# EAGLE design icp (EAGLE 6.3)
Assembly variants: Reichelt
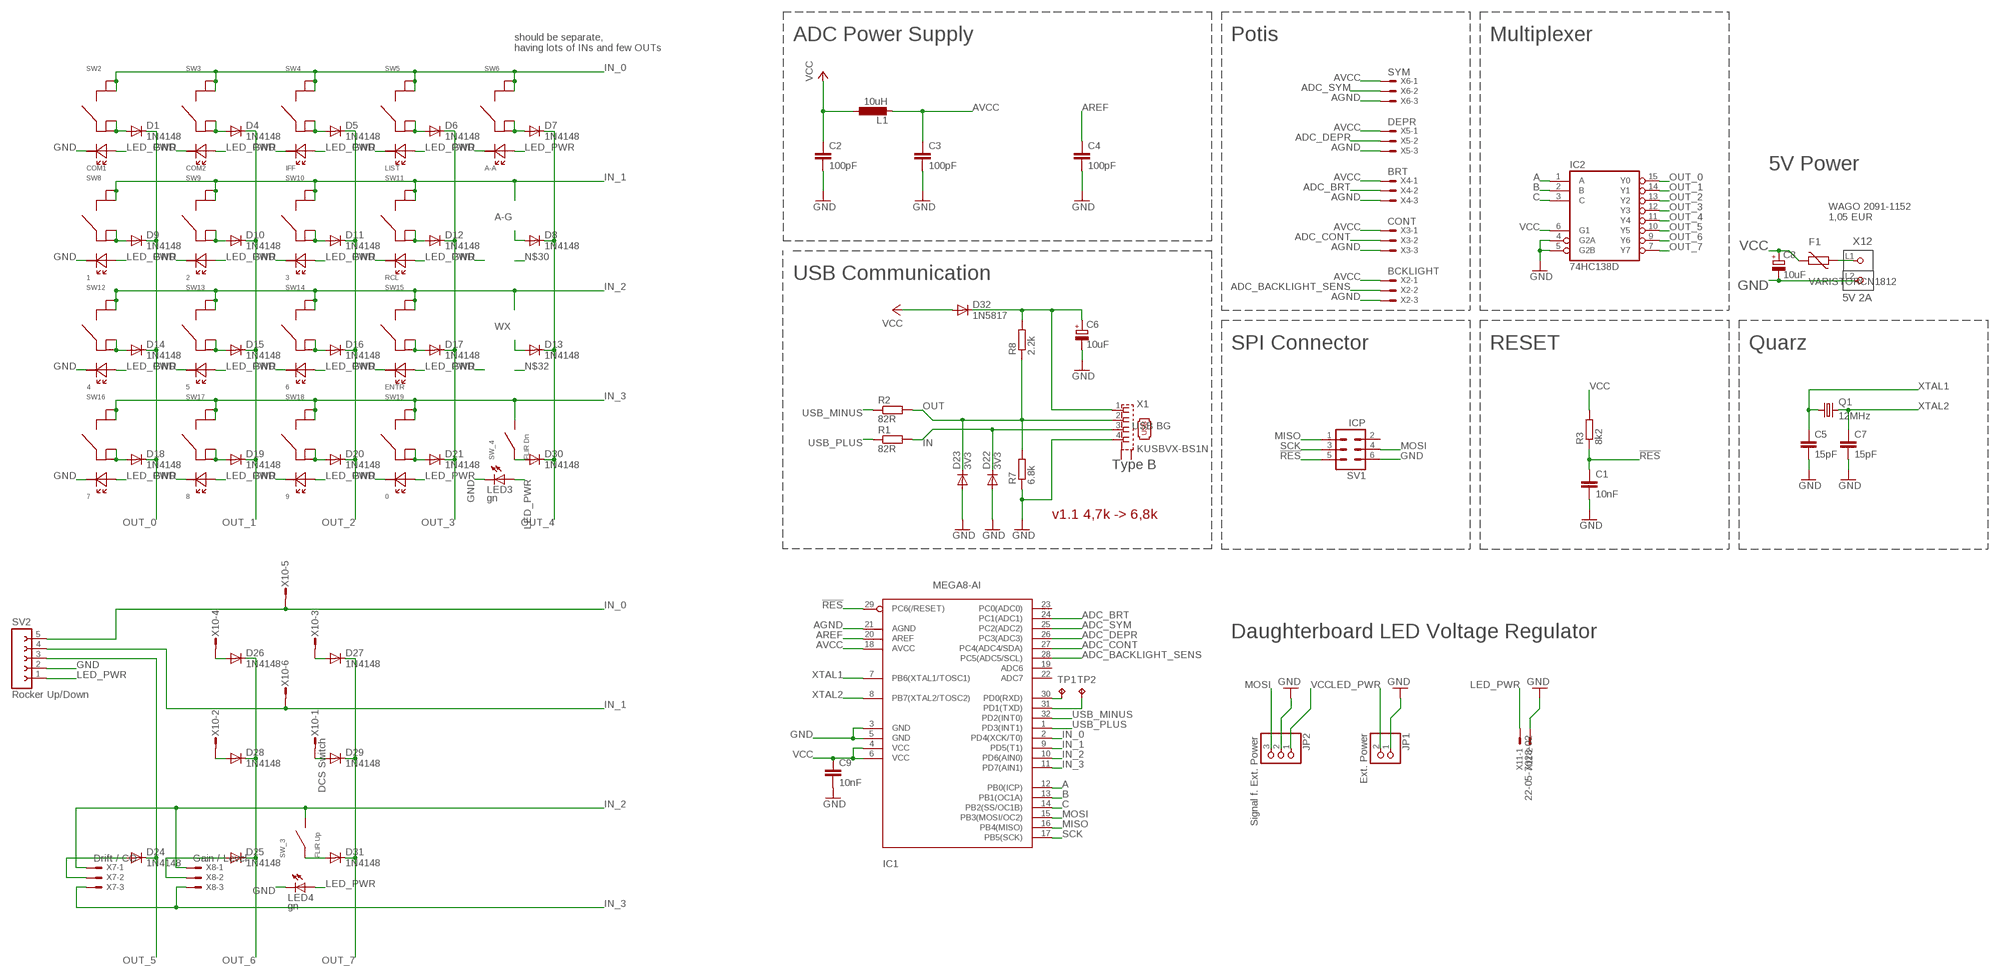
[diagram p0: schematic, sheet 1]

## Parts
C1  10nF  C-EUC1206  [C1206]
C2  100pF  C-EUC0805  [C0805]
C3  100pF  C-EUC0805  [C0805]
C4  100pF  C-EUC0805  [C0805]
C5  15pF  C-EUC0805  [C0805]
C6  10uF  CPOL-EUE2-5  [E2-5]  (variant Reichelt: RAD 10/100)
C7  15pF  C-EUC0805  [C0805]
C8  10uF  CPOL-EUE2-5  [E2-5]
C9  10nF  C-EUC1206  [C1206]
D1  1N4148  DIODE-DO35-10  [DO35-10]
D4  1N4148  DIODE-DO35-10  [DO35-10]
D5  1N4148  DIODE-DO35-10  [DO35-10]
D6  1N4148  DIODE-DO35-10  [DO35-10]
D7  1N4148  DIODE-DO35-10  [DO35-10]
D8  1N4148  DIODE-DO35-10  [DO35-10]
D9  1N4148  DIODE-DO35-10  [DO35-10]
D10  1N4148  DIODE-DO35-10  [DO35-10]
D11  1N4148  DIODE-DO35-10  [DO35-10]
D12  1N4148  DIODE-DO35-10  [DO35-10]
D13  1N4148  DIODE-DO35-10  [DO35-10]
D14  1N4148  DIODE-DO35-10  [DO35-10]
D15  1N4148  DIODE-DO35-10  [DO35-10]
D16  1N4148  DIODE-DO35-10  [DO35-10]
D17  1N4148  DIODE-DO35-10  [DO35-10]
D18  1N4148  DIODE-DO35-10  [DO35-10]
D19  1N4148  DIODE-DO35-10  [DO35-10]
D20  1N4148  DIODE-DO35-10  [DO35-10]
D21  1N4148  DIODE-DO35-10  [DO35-10]
D22  3V3  DIODE-D-5  [D-5]
D23  3V3  DIODE-D-5  [D-5]
D24  1N4148  DIODE-DO35-10  [DO35-10]
D25  1N4148  DIODE-DO35-10  [DO35-10]
D26  1N4148  DIODE-DO35-10  [DO35-10]
D27  1N4148  DIODE-DO35-10  [DO35-10]
D28  1N4148  DIODE-DO35-10  [DO35-10]
D29  1N4148  DIODE-DO35-10  [DO35-10]
D30  1N4148  DIODE-DO35-10  [DO35-10]
D31  1N4148  DIODE-DO35-10  [DO35-10]
D32  1N5817  DIODE-DO35-10  [DO35-10]
F1  VARISTORCN1812  [CT/CN1812]
IC1  MEGA8-AI  [TQFP32-08]
IC2  74HC138D  [SO16]
JP1  Ext. Power  PINHD-1X2  [1X02]
JP2  Signal f. Ext. Power  PINHD-1X3  [1X03]
L1  10uH  L-EU0207/15  [0207/15]
LED3  gn  LEDCHIPLED_1206  [CHIPLED_1206]
LED4  gn  LEDCHIPLED_1206  [CHIPLED_1206]
Q1  12MHz  CRYSTALHC49U-V  [HC49U-V]
R1  82R  R-EU_R0805W  [R0805W]
R2  82R  R-EU_R0805W  [R0805W]
R3  8k2  R-EU_R0805  [R0805]
R7  6.8k  R-EU_0207/5V  [0207/5V]  (variant Reichelt: SMD-0805 4,70k)
R8  2.2k  R-EU_R0805  [R0805]  (variant Reichelt: SMD-0805 2,20k)
SV1  ICP  MA03-2  [MA03-2]
SV2  Rocker Up/Down  FE05-1  [FE05-1]
SW2  COM1  3FTL620  [3FTL620]
SW3  COM2  3FTL620  [3FTL620]
SW4  IFF  3FTL620  [3FTL620]
SW5  LIST  3FTL620  [3FTL620]
SW6  A-A  3FTL620  [3FTL620]
SW8  1  3FTL620  [3FTL620]
SW9  2  3FTL620  [3FTL620]
SW10  3  3FTL620  [3FTL620]
SW11  RCL  3FTL620  [3FTL620]
SW12  4  3FTL620  [3FTL620]
SW13  5  3FTL620  [3FTL620]
SW14  6  3FTL620  [3FTL620]
SW15  ENTR  3FTL620  [3FTL620]
SW16  7  3FTL620  [3FTL620]
SW17  8  3FTL620  [3FTL620]
SW18  9  3FTL620  [3FTL620]
SW19  0  3FTL620  [3FTL620]
SW_3  FLIR Up  APEM_SWITCH  [TYPE_A]
SW_4  FLIR Dn  APEM_SWITCH  [TYPE_A]
TP1  TPTP06SQ  [TP06SQ]
TP2  TPTP06SQ  [TP06SQ]
X1  KUSBVX-BS1N  [KUSBVX-BS1N]
X2  BCKLIGHT  22-23-2031  [22-23-2031]
X3  CONT  22-23-2031  [22-23-2031]
X4  BRT  22-23-2031  [22-23-2031]
X5  DEPR  22-23-2031  [22-23-2031]
X6  SYM  22-23-2031  [22-23-2031]
X7  Drift / CO  22-23-2031  [22-23-2031]
X8  Gain / Level  22-23-2031  [22-23-2031]
X10  DCS Switch  MICROMATCH-6  [MICROMATCH-6]
X11  22-05-7028-02  [7395-02]
X12  5V 2A  2091-1152  [P-2091-1152]

## Nets
!RES: C1.1 IC1.29(PC6(/RESET)) R3.1 SV1.5
A: IC1.12(PB0(ICP)) IC2.1(A)
ADC_BACKLIGHT_SENS: IC1.28(PC5(ADC5/SCL)) X2.2
ADC_BRT: IC1.24(PC1(ADC1)) X4.2
ADC_CONT: IC1.27(PC4(ADC4/SDA)) X3.2
ADC_DEPR: IC1.26(PC3(ADC3)) X5.2
ADC_SYM: IC1.25(PC2(ADC2)) X6.2
AGND: IC1.21(AGND) X2.3 X3.3 X4.3 X5.3 X6.3
AREF: C4.1 IC1.20(AREF)
AVCC: C3.1 IC1.18(AVCC) L1.2 X2.1 X3.1 X4.1 X5.1 X6.1
B: IC1.13(PB1(OC1A)) IC2.2(B)
C: IC1.14(PB2(SS/OC1B)) IC2.3(C)
GND: C1.2 C2.2 C3.2 C4.2 C5.2 C6.- C7.2 C8.- C9.2 D22.A D23.A IC1.3(GND) IC1.5(GND) IC2.4(G2A) IC2.5(G2B) JP1.1 JP2.2 LED3.C LED4.C R7.1 SV1.6 SV2.2 SW2.P$6(LED$4) SW3.P$6(LED$4) SW4.P$6(LED$4) SW5.P$6(LED$4) SW6.P$6(LED$4) SW8.P$6(LED$4) SW9.P$6(LED$4) SW10.P$6(LED$4) SW11.P$6(LED$4) SW12.P$6(LED$4) SW13.P$6(LED$4) SW14.P$6(LED$4) SW15.P$6(LED$4) SW16.P$6(LED$4) SW17.P$6(LED$4) SW18.P$6(LED$4) SW19.P$6(LED$4) X1.4 X11.2 X12.L2(P2)
IN: D22.C R1.2 X1.3
IN_0: IC1.2(PD4(XCK/T0)) SV2.5 SW2.P$1 SW2.P$3 SW3.P$1 SW3.P$3 SW4.P$1 SW4.P$3 SW5.P$1 SW5.P$3 SW6.P$1 SW6.P$3 X10.5
IN_1: IC1.9(PD5(T1)) SV2.4 SW8.P$1 SW8.P$3 SW9.P$1 SW9.P$3 SW10.P$1 SW10.P$3 SW11.P$1 SW11.P$3 X10.6
IN_2: IC1.10(PD6(AIN0)) SW12.P$1 SW12.P$3 SW13.P$1 SW13.P$3 SW14.P$1 SW14.P$3 SW15.P$1 SW15.P$3 SW_3.P$1 X7.1 X8.1
IN_3: IC1.11(PD7(AIN1)) SW16.P$1 SW16.P$3 SW17.P$1 SW17.P$3 SW18.P$1 SW18.P$3 SW19.P$1 SW19.P$3 SW_4.P$1 X7.3 X8.3
LED_PWR: JP1.2 LED3.A LED4.A SV2.1 SW2.P$5(LED$3) SW3.P$5(LED$3) SW4.P$5(LED$3) SW5.P$5(LED$3) SW6.P$5(LED$3) SW8.P$5(LED$3) SW9.P$5(LED$3) SW10.P$5(LED$3) SW11.P$5(LED$3) SW12.P$5(LED$3) SW13.P$5(LED$3) SW14.P$5(LED$3) SW15.P$5(LED$3) SW16.P$5(LED$3) SW17.P$5(LED$3) SW18.P$5(LED$3) SW19.P$5(LED$3) X11.1
MISO: IC1.16(PB4(MISO)) SV1.1
MOSI: IC1.15(PB3(MOSI/OC2)) JP2.3 SV1.4
N$1: C6.+ D32.C R8.2 X1.1
N$2: D7.A SW6.P$2 SW6.P$4
N$3: D30.A SW_4.P$2
N$4: F1.1 X12.L1(P1)
N$5: D31.A SW_3.P$2
N$7: D24.A X7.2
N$8: D25.A X8.2
N$9: D26.A X10.4
N$10: D28.A X10.2
N$11: D27.A X10.3
N$12: D1.A SW2.P$2 SW2.P$4
N$13: D9.A SW8.P$2 SW8.P$4
N$14: D4.A SW3.P$2 SW3.P$4
N$15: D5.A SW4.P$2 SW4.P$4
N$16: D6.A SW5.P$2 SW5.P$4
N$17: D12.A SW11.P$2 SW11.P$4
N$18: D11.A SW10.P$2 SW10.P$4
N$19: D10.A SW9.P$2 SW9.P$4
N$20: D14.A SW12.P$2 SW12.P$4
N$21: D15.A SW13.P$2 SW13.P$4
N$22: D16.A SW14.P$2 SW14.P$4
N$23: D17.A SW15.P$2 SW15.P$4
N$24: D18.A SW16.P$2 SW16.P$4
N$25: D19.A SW17.P$2 SW17.P$4
N$26: D20.A SW18.P$2 SW18.P$4
N$27: D21.A SW19.P$2 SW19.P$4
N$28: D13.A
N$29: D29.A X10.1
N$133: D8.A
OUT: D23.C R2.2 R7.2 R8.1 X1.2
OUT_0: D1.C D9.C D14.C D18.C IC2.15(Y0)
OUT_1: D4.C D10.C D15.C D19.C IC2.14(Y1)
OUT_2: D5.C D11.C D16.C D20.C IC2.13(Y2)
OUT_3: D6.C D12.C D17.C D21.C IC2.12(Y3)
OUT_4: D7.C D8.C D13.C D30.C IC2.11(Y4)
OUT_5: D24.C IC2.10(Y5) SV2.3
OUT_6: D25.C D26.C D28.C IC2.9(Y6)
OUT_7: D27.C D29.C D31.C IC2.7(Y7)
RX: IC1.30(PD0(RXD)) TP1.TP
SCK: IC1.17(PB5(SCK)) SV1.3
TX: IC1.31(PD1(TXD)) TP2.TP
USB_MINUS: IC1.32(PD2(INT0)) R2.1
USB_PLUS: IC1.1(PD3(INT1)) R1.1
VCC: C2.1 C8.+ C9.1 D32.A F1.2 IC1.4(VCC) IC1.6(VCC) IC2.6(G1) JP2.1 L1.1 R3.2
XTAL1: C5.1 IC1.7(PB6(XTAL1/TOSC1)) Q1.1
XTAL2: C7.1 IC1.8(PB7(XTAL2/TOSC2)) Q1.2
Unconnected: IC1.19(ADC6) IC1.22(ADC7) IC1.23(PC0(ADC0)) SV1.2 X1.M1(S1) X1.M2(S2)

## Notes on the sheet
- ADC Power Supply | Potis | Multiplexer
- should be separate,
  having lots of INs and few OUTs
- 5V Power
- A-G
- WAGO 2091-1152
  1,05 EUR
- USB Communication
- WX
- SPI Connector | RESET | Quarz
- Type B
- v1.1 4,7k -> 6,8k
- Daughterboard LED Voltage Regulator

## Power pins joined to a net without a drawn wire
GND: IC2.8(GND)
VCC: IC2.16(VCC)

## Library data of the parts
C1-C5 C7 C9 = rcl:C-EU: CAPACITOR, European symbol
C6 C8 = rcl:CPOL-EU: POLARIZED CAPACITOR, European symbol
D1 D4-D32 = diode:DIODE-: DIODE
F1 = varistor:VARISTOR: VARISTOR
IC1 = avr-6:MEGA8: MICROCONTROLLER 8 Kbytes FLASH 1 kbytes SRAM 512 bytes EEPROM USART 6-channel 10 bit ADC 2-channel 8 bit ADC
IC2 = 74xx-eu:74*138: 3-line to 8-line DECODER/DEMULTIPLEXER
JP1 = pinhead:PINHD-1X2: PIN HEADER
JP2 = pinhead:PINHD-1X3: PIN HEADER
L1 = rcl:L-EU: INDUCTOR, European symbol
LED3 LED4 = led:LED: LED OSRAM: - CHIPLED LG R971, LG N971, LY N971, LG Q971, LY Q971, LO R971, LY R971 LH N974, LH R974 LS Q976, LO Q976, LY Q976 LO Q996 - Hyper CHIPLED LW Q18S LB Q993, LB Q99A, LB R99A - SideLED LS A670, LO A670, LY A670, LG A670, LP A670 LB A673, LV A673, LT A673, LW A673 LH A674 LY A675 LS A676, LA A676, LO A676, LY A676, LW A676 LS A679, LY A679, LG A679 - Hyper Micro SIDELED® LS Y876, LA Y876, LO Y876, LY Y876 LT Y87S - SmartLED LW L88C, LW L88S LB L89C, LB L89S, LG L890 LS L89K, LO L89K, LY L89K LS L896, LA L896, LO L896, LY L896 - TOPLED LS T670, LO T670, LY T670, LG T670, LP T670 LSG T670, LSP T670, LSY T670, LOP T670, LYG T670 LG T671, LOG T671, LSG T671 LB T673, LV T673, LT T673, LW T673 LH T674 LS T676, LA T676, LO T676, LY T676, LB T676, LH T676, LSB T676, LW T676 LB T67C, LV T67C, LT T67C, LS T67K, LO T67K, LY T67K, LW E67C LS E67B, LA E67B, LO E67B, LY E67B, LB E67C, LV E67C, LT E67C LW T67C LS T679, LY T679, LG T679 LS T770, LO T770, LY T770, LG T770, LP T770 LB T773, LV T773, LT T773, LW T773 LH T774 LS E675, LA E675, LY E675, LS T675 LS T776, LA T776, LO T776, LY T776, LB T776 LHGB T686 LT T68C, LB T68C - Hyper Mini TOPLED® LB M676 - Mini TOPLED Santana® LG M470 LS M47K, LO M47K, LY M47K Source: http://www.osram.convergy.de LUXEON: - LUMILED® LXK2-PW12-R00, LXK2-PW12-S00, LXK2-PW14-U00, LXK2-PW14-V00 LXK2-PM12-R00, LXK2-PM12-S00, LXK2-PM14-U00 LXK2-PE12-Q00, LXK2-PE12-R00, LXK2-PE12-S00, LXK2-PE14-T00, LXK2-PE14-U00 LXK2-PB12-K00, LXK2-PB12-L00, LXK2-PB12-M00, LXK2-PB14-N00, LXK2-PB14-P00, LXK2-PB14-Q00 LXK2-PR12-L00, LXK2-PR12-M00, LXK2-PR14-Q00, LXK2-PR14-R00 LXK2-PD12-Q00, LXK2-PD12-R00, LXK2-PD12-S00 LXK2-PH12-R00, LXK2-PH12-S00 LXK2-PL12-P00, LXK2-PL12-Q00, LXK2-PL12-R00 Source: www.luxeon.com KINGBRIGHT: KA-3528ASYC Source: www.kingbright.com
Q1 = crystal:CRYSTAL: CRYSTAL
R1-R3 R7 R8 = rcl:R-EU_: RESISTOR, European symbol
SV1 = con-lstb:MA03-2: PIN HEADER
SV2 = con-lsta:FE05-1: FEMALE HEADER; OC_FARNELL: unknown; OC_NEWARK: unknown
SW2-SW6 SW8-SW19 = switches:3FTL6: Taster Serie 3FTL6 mit 3N Betätigungskraft
SW_3 SW_4 = switches:APEM_SWITCH: slim single pole switches; RS_ONLINE: 378-6296
TP1 TP2 = testpad:TP: Test pad
X1 = con-kycon:KUSBVX-BS1N: USB B-type Receptacle Vertical, 4 Position, Through Hole Source: Sibalco Kycon KUSBVX-BS1N-xxx.pdf; REICHELT: USB BG
X2-X8 = con-molex:22-23-2031: .100" (2.54mm) Center Header - 3 Pin; MF: MOLEX; MPN: 22-23-2031; OC_FARNELL: 1462950; OC_NEWARK: 30C0862
X10 = con-amp-micromatch:MICROMATCH-6: MicroMaTch 6 7-215464-6 / 0-215464-6 Drawing Number C-215464 DDEController.pdf; MPN: 7-215464-6; OC_FARNELL: 3784630; OC_NEWARK: 19R8125
X11 = con-molex:22-?-02: CONNECTOR wire to board 2.54 mm (.1 inch) pitch header; OC_FARNELL: 9731601; OC_NEWARK: unknown
X12 = con-wago_3.5 mm:2091-1152: Serie 2091, Federleiste eCOM mit geraden Lötstiften mit Griffplatte / Series 2091, eCOM pluggable PCB connector with straight solder pins with gripping plate Polzahl / Pole No.: 2 Rastermaß / Pitch: 3.5 mm Bemessungsspannung / Rated Voltage: 160 V Nennstrom / Nominal Current: 10 A Leiterquerschnitt / Conductor Size: 0.2 - 1.5 mm² Anschlusstechnik / Connection Technology: CAGE CLAMP® S Lötstiftlänge: / Solder Pin Length: 3.6 mm Farbe / Color: lichtgrau / light gray Stand: 01.01.2013. Die jeweils aktuellen Daten zu diesem Artikel finden Sie in unserem Produktkatalog, den Sie unter www.wago.com einsehen können. As of: 01/01/2013. Please find the newest data for this article in our product catalogue, which can be viewed under www.wago.com.

## Board
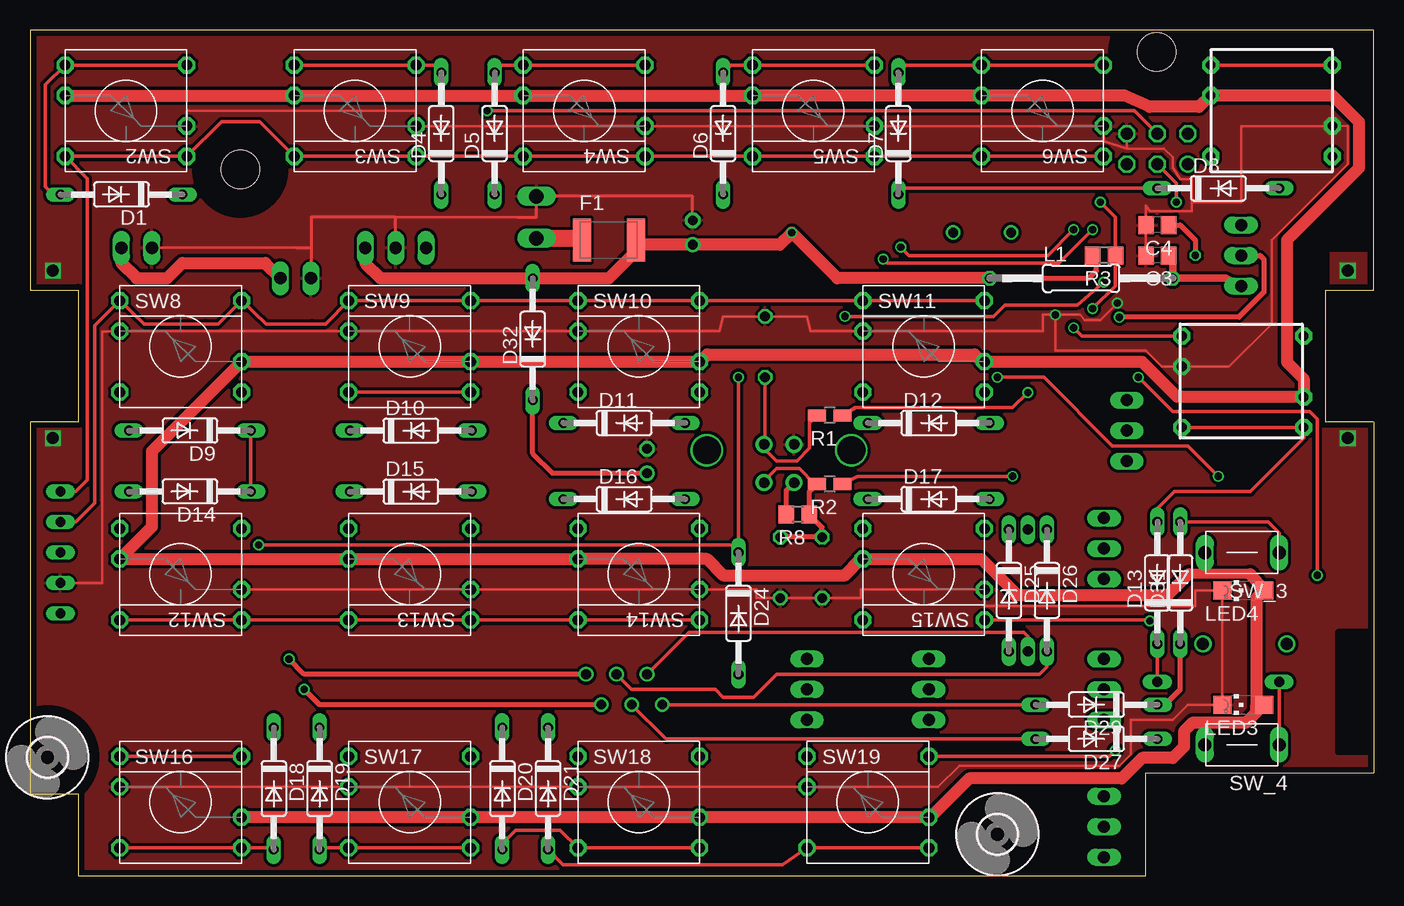
[diagram p1: board, top side]
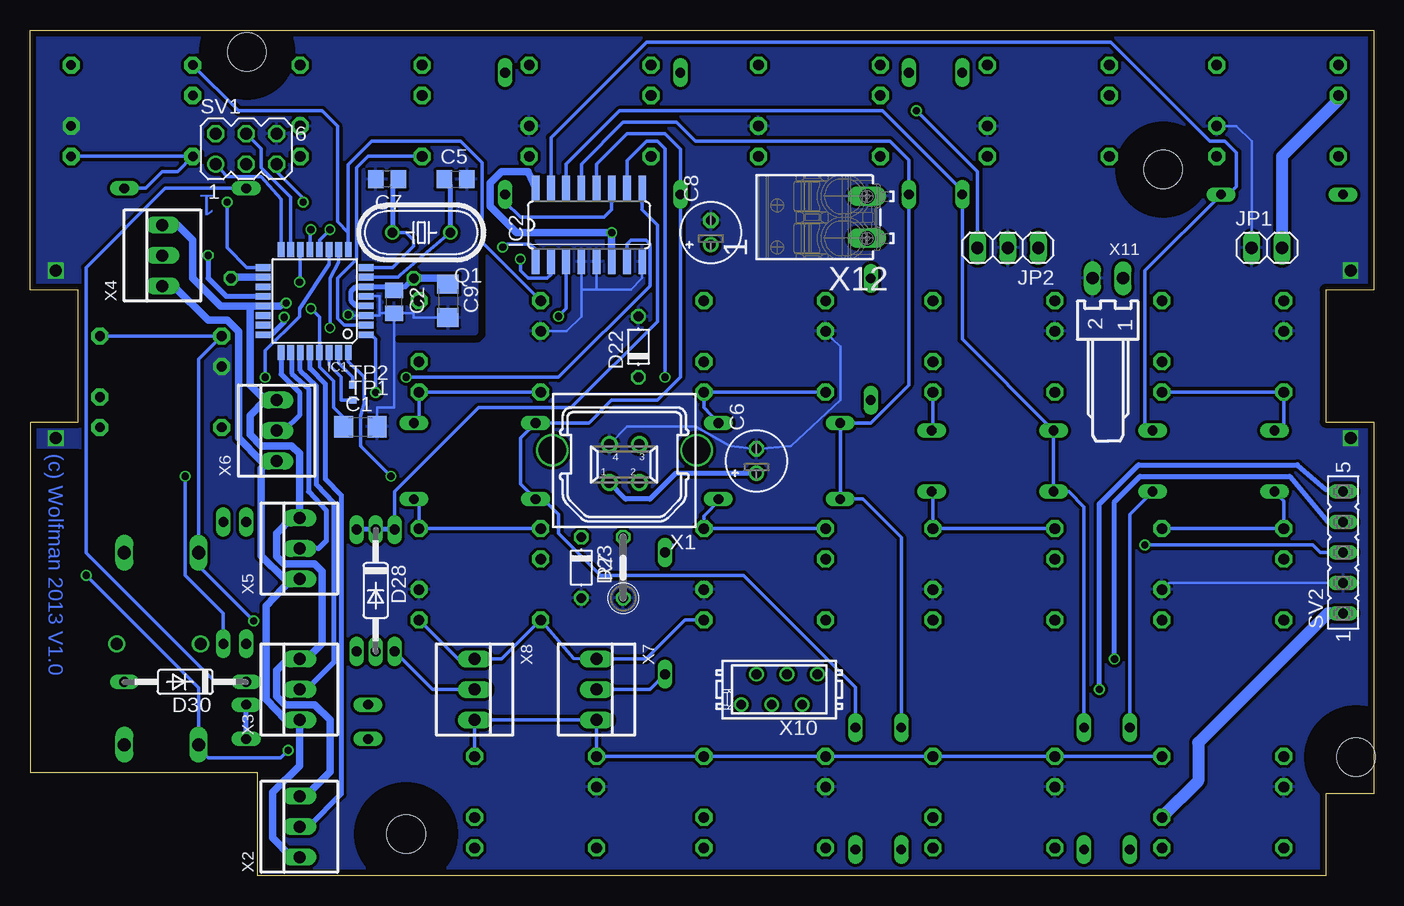
[diagram p2: board, bottom side, seen from below]

Size 112 x 70.5 mm. Coordinates in mm from the lower left corner, seen from the top.
Outline: 4,0 93.03,0 93.03,8.55 112,8.55 112,37.82 108,37.82 108,48.82 112,48.82 112,70.5 0,70.5 0,48.82 4,48.82 4,37.82 0,37.82 0,6.82 4,6.82 4,0
Copper layers (1*16): Top 0.035mm / dielectric 1.5mm / Bottom 0.035mm
Design rules "PCB-POOL": minimum track width 6mil, minimum drill 12mil, track to track 6mil, track to pad 6mil, pad to pad 6mil, via to via 6mil, smd to smd 6mil, copper to edge 20mil, drill to drill 8mil, minimum pad ring 8mil, minimum via ring 6mil, stop-mask expansion 3mil, vias tented up to drill 0mil, thermal gap 8mil
Holes 3.2 mm at 17.54,58.87 93.9,68.67
tRestrict: area 13.9,55.3 to 21.1,62.5; area 90.3,65.1 to 97.5,72.3; area 109,10.3 to 111.8,20.3; 2 lines
bRestrict: area 13.9,55.3 to 21.1,62.5; area 90.3,65.1 to 97.5,72.3; 4 lines

### Footprints (pad centres in the part's own frame; a part is rotated, then mirrored left to right if it is on the bottom)
C1206 = smd 1.6 x 1.8: 1 -1.4,0; 2 1.4,0
C0805 = smd 1.3 x 1.5: 1 -0.95,0; 2 0.95,0
E2-5 = drill 0.813 pad 1.27: + -1.016,0 | drill 0.813 pad 1.27 octagon: - 1.016,0
DO35-10 = drill 0.813 long: A 5.08,0; C -5.08,0
D-5 = drill 0.813 octagon: A 2.54,0; C -2.54,0
CT/CN1812 = smd 1.5 x 3.6: 1 -2.25,0; 2 2.25,0
TQFP32-08 = smd 1.27 x 0.559: 1 -4.293,2.8; 2 -4.293,2; 3 -4.293,1.2; 4 -4.293,0.4; 5 -4.293,-0.4; 6 -4.293,-1.2; 7 -4.293,-2; 8 -4.293,-2.8; 17 4.293,-2.8; 18 4.293,-2; 19 4.293,-1.2; 20 4.293,-0.4; 21 4.293,0.4; 22 4.293,1.2; 23 4.293,2; 24 4.293,2.8 | smd 0.559 x 1.27: 9 -2.8,-4.293; 10 -2,-4.293; 11 -1.2,-4.293; 12 -0.4,-4.293; 13 0.4,-4.293; 14 1.2,-4.293; 15 2,-4.293; 16 2.8,-4.293; 25 2.8,4.293; 26 2,4.293; 27 1.2,4.293; 28 0.4,4.293; 29 -0.4,4.293; 30 -1.2,4.293; 31 -2,4.293; 32 -2.8,4.293
SO16 = smd 0.66 x 2.032: 1 -4.445,-3.073; 2 -3.175,-3.073; 3 -1.905,-3.073; 4 -0.635,-3.073; 5 0.635,-3.073; 6 1.905,-3.073; 7 3.175,-3.073; 8 4.445,-3.073; 9 4.445,3.073; 10 3.175,3.073; 11 1.905,3.073; 12 0.635,3.073; 13 -0.635,3.073; 14 -1.905,3.073; 15 -3.175,3.073; 16 -4.445,3.073
1X02 = drill 1.016 long: 1 -1.27,0; 2 1.27,0
1X03 = drill 1.016 long: 1 -2.54,0; 2 0,0; 3 2.54,0
0207/15 = drill 0.813 octagon: 1 -7.62,0; 2 7.62,0
CHIPLED_1206 = smd 1.5 x 1.5: A 0,-1.75; C 0,1.75
HC49U-V = drill 0.813: 1 -2.413,0; 2 2.413,0
R0805W = smd 1.5 x 1: 1 -1.052,0; 2 1.052,0
R0805 = smd 1.3 x 1.5: 1 -0.95,0; 2 0.95,0
0207/5V = drill 0.813 octagon: 1 -2.54,0; 2 2.54,0
MA03-2 = drill 1.016: 1 -2.54,-1.27 | drill 1.016 octagon: 2 -2.54,1.27; 3 0,-1.27; 4 0,1.27; 5 2.54,-1.27; 6 2.54,1.27
FE05-1 = drill 0.813 long: 1 -5.08,0; 2 -2.54,0; 3 0,0; 4 2.54,0; 5 5.08,0
3FTL620 = drill 0.9 pad 1.422 octagon: P$1 -5.08,3.81; P$2 -5.08,-3.81; P$3 5.08,3.81; P$4 5.08,-3.81; P$5 5.08,-1.27; P$6 -5.08,1.27
TYPE_A = drill 1.1 long: P$1 0,3.1; P$2 0,-3.1
TP06SQ = smd 0.6 x 0.6: TP 0,0
3,2 = hole 3.2: 0,0
KUSBVX-BS1N = drill 0.9 pad 1.422: 1 1.25,2.7; 2 -1.25,2.7; 3 -1.25,-0.5; 4 1.25,-0.5 | drill 2.3 pad 2.7: M1 -6.02,0; M2 6.02,0
22-23-2031 = drill 1 long: 1 -2.54,0; 2 0,0; 3 2.54,0
MICROMATCH-6 = drill 0.813: 1 3.175,1.27; 2 1.905,-1.27; 3 0.635,1.27; 4 -0.635,-1.27; 5 -1.905,1.27; 6 -3.175,-1.27
7395-02 = drill 1.016 long: 1 1.27,0; 2 -1.27,0
P-2091-1152 = drill 1.2 long: L1 -3.5,1.75; L2 -3.5,-1.75

### Placement (x,y rotation side)
C1  84.46,37.42 0 bottom
C2  81.66,47.84 270 bottom
C3  93.98,51.7 180 top
C4  93.98,54.24 180 top
C5  76.52,58.05 0 bottom
C6  51.44,34.56 90 bottom
C7  82.23,58.05 180 bottom
C8  55.24,53.61 90 bottom
C9  77.15,47.92 270 bottom
D1  7.62,56.78 180 top
D4  34.29,61.86 90 top
D5  38.73,61.86 90 top
D6  57.78,61.86 90 top
D7  72.39,61.86 90 top
D8  99.06,57.3 0 top
D9  13.34,37.1 180 top
D10  31.75,37.1 0 top
D11  49.53,37.73 0 top
D12  74.93,37.73 0 top
D13  93.98,24.4 90 top
D14  13.34,32.02 180 top
D15  31.75,32.02 0 top
D16  49.53,31.39 0 top
D17  74.93,31.39 0 top
D18  20.32,7.25 270 top
D19  24.13,7.25 270 top
D20  39.37,7.25 270 top
D21  43.18,7.25 270 top
D22  61.28,44.08 90 bottom
D23  66.04,25.67 270 bottom
D24  59.05,21.86 270 top
D25  81.6,23.77 270 top
D26  84.77,23.77 270 top
D27  88.9,11.38 180 top
D28  83.19,23.77 270 bottom
D29  88.9,14.24 180 top
D30  99.06,16.14 180 bottom
D31  95.89,24.4 90 top
D32  41.91,44.72 90 top
F1  48.26,52.97 0 top
IC1  88.27,47.89 180 bottom
IC2  65.41,54.24 0 bottom
JP1  8.89,52.34 0 bottom
JP2  30.48,52.34 180 bottom
L1  87.63,49.8 0 top
LED3  101.13,14.24 90 top
LED4  101.13,23.77 90 top
Q1  79.38,53.61 180 bottom
R1  66.68,38.37 180 top
R2  66.68,32.66 180 top
R3  89.54,51.7 180 top
R7  62.55,25.67 90 bottom
R8  64.01,30.11 180 top
SV1  93.98,60.59 0 bottom
SV2  2.54,26.94 90 bottom
SW2  8,63.77 180 top
SW3  27.1,63.77 180 top
SW4  46.2,63.77 180 top
SW5  65.3,63.77 180 top
SW6  84.4,63.77 180 top
SW8  12.55,44.11 0 top
SW9  31.65,44.11 0 top
SW10  50.75,44.11 0 top
SW11  74.5,44.11 0 top
SW12  12.55,25.11 180 top
SW13  31.65,25.11 180 top
SW14  50.75,25.11 180 top
SW15  74.5,25.11 180 top
SW16  12.55,6.11 0 top
SW17  31.65,6.11 0 top
SW18  50.75,6.11 0 top
SW19  69.85,6.11 0 top
SW_3  101.04,26.92 90 top
SW_4  101.04,10.9 90 top
TP1  85.09,39.64 0 bottom
TP2  85.09,40.91 0 bottom
U$5  [3,2]  80.65,3.45 0 top
U$7  [3,2]  1.45,9.86 0 top
X1  62.45,35.45 180 bottom
X2  89.54,4.08 90 bottom
X3  89.54,15.51 90 bottom
X4  100.97,51.7 90 bottom
X5  89.54,27.26 90 bottom
X6  91.44,37.1 90 bottom
X7  64.77,15.51 270 bottom
X8  74.93,15.51 270 bottom
X10  49.53,15.51 180 bottom
X11  22.15,49.8 0 bottom
X12  45.72,54.88 180 bottom

### Tracks (layer width: path | path; a pad name or v marks a point on that pad's centre or on a via)
!RES  (via drill 0.6)
  Top 0.305: v89.22,56.15 90.49,54.88 R3.1 90.49,50.43 90.49,49.17 v88.58,47.26
  Bottom 0.305: SV1.5 91.44,58.69 89.22,56.47 v89.22,56.15 | v88.58,47.26 87.87,46.54 IC1.29 87.87,42.41 86.68,41.23 86.68,39 85.86,38.18 C1.1
A  (via drill 0.6)
  Top 0.305: v87,53.86 84.84,51.7 73.29,51.7 v72.59,52.41
  Bottom 0.305: IC2.1 69.85,52.21 70.3,52.66 72.21,52.66 v72.59,52.41 | IC1.12 87.87,52.99 v87,53.86
ADC_BACKLIGHT_SENS
  Bottom 0.406: X2.2 88.76,4.08 86.04,6.79 86.04,31.7 87.4,33.06 87.4,40.99 88.67,42.26 IC1.28
ADC_BRT  (via drill 0.6)
  Top 0.406: X4.2 102.55,51.7 102.87,51.39 102.87,48.63 100.79,46.55 v90.81,46.55
  Bottom 0.406: IC1.24 91.85,45.09 90.81,46.14 v90.81,46.55
ADC_CONT
  Bottom 0.406: X3.2 88.92,15.51 86.68,17.75 86.68,31.07 88.14,32.58 88.14,40.84 89.47,42.11 IC1.27
ADC_DEPR
  Bottom 0.406: IC1.26 90.17,43.51 90.17,41.86 88.77,40.59 88.77,32.02 87.31,30.43 87.31,27.89 87.95,27.26 X5.2
ADC_SYM
  Bottom 0.406: IC1.25 91.07,41.81 89.54,40.28 89.54,38.37 90.81,37.1 X6.2
AGND
  Bottom 0.61: 93.66,47.5 93.66,40.91 92.39,39.64 | 93.66,47.5 IC1.21 91.21,47.5 90.59,47.78 | X2.3 89,6.62 87,8.63 87,12.97 88.27,14.24 90.73,14.24 91.44,14.95 91.44,17.1 90.49,18.05 X3.3 88.94,18.05 87.63,19.36 87.63,25.35 88.27,25.99 90.81,25.99 91.44,26.62 91.44,28.53 90.17,29.8 X5.3 89.54,35.2 90.17,35.83 92.71,35.83 93.66,36.78 93.66,38.37 92.39,39.64 | 92.39,39.64 X6.3 | 93.66,47.5 96.12,47.5 98.43,49.8 98.43,52.97 99.7,54.24 X4.3
AREF  (via drill 0.6)
  Top 0.406: C4.1 95.89,54.24 97.16,52.97 v97.16,51.7
  Bottom 0.406: v97.16,51.7 97.16,49.8 95.65,48.3 IC1.20
AVCC
  Top 0.61: X4.1 99.7,49.8 L1.2 95.25,51.07 C3.1
  Bottom 0.61: L1.2 95.16,49.89 IC1.18 | X6.1 92.08,34.56 | 92.08,34.56 92.71,34.56 94.62,36.47 94.62,45.36 95.57,46.31 97.16,46.31 100.01,49.17 X4.1 | X2.1 90.17,1.54 91.76,3.13 91.76,6.94 89.54,9.16 X3.1 90.68,12.97 92.3,14.68 92.3,22.5 90.17,24.72 | X5.1 90.17,24.72 | 90.17,24.72 90.78,24.72 92.71,26.65 92.71,33.92 92.08,34.56
B  (via drill 0.6)
  Top 0.305: v88.58,53.86 85.79,51.07 71.44,51.07 v71.12,51.39
  Bottom 0.305: IC2.2 68.58,50.12 68.9,49.8 70.48,49.8 71.12,50.44 v71.12,51.39 | IC1.13 88.67,53.61 v88.58,53.86
C  (via drill 0.6)
  Top 0.305: v89.54,49.48 87.31,47.58 81.28,47.58 80.33,46.62 v67.95,46.62
  Bottom 0.305: IC1.14 89.47,49.48 v89.54,49.48 | IC2.3 67.31,47.26 v67.95,46.62
GND  (via drill 0.6, 0.8 pad 1.42, 1)
  Top 0.203: SW2.P$6 13.08,63.77 32.15,63.77 32.15,62.5 SW3.P$6 SW4.P$6 SW5.P$6 SW6.P$6 | SW12.P$6 SW13.P$6 SW14.P$6 60.57,23.84 60.57,23.13 R7.1 D23.A 69.29,23.13 69.29,23.84 SW15.P$6 79.58,22.5 97.16,22.5 97.16,23.77 LED4.C LED3.C 96.52,14.24 95.25,12.97 91.76,12.97 91.76,10.11 90.81,9.16 77.47,9.16 75.69,7.38 SW19.P$6 SW18.P$6 SW17.P$6 SW16.P$6 | SV2.2 6.03,24.4 6.03,45.36 6.35,45.36 SW8.P$6 SW9.P$6 SW10.P$6 57.49,45.38 57.78,46.62 D22.A 64.77,46.62 65.06,45.38 SW11.P$6 84.46,45.38 84.46,46.75 v85.47,46.75 | 96.84,56.15 96.84,55.39 93.35,55.39 93.03,55.83 C4.2 C3.2 | 96.84,56.15 96.84,58.05 95.89,58.05 95.25,59.01 95.25,59.88 94.54,60.59 91.44,60.59 | 89.54,62.5 89.54,61.23 91.44,60.59 | 91.44,60.59 SV1.6 | v90.65,47.74 89.22,46.31 87.95,46.31 87.5,46.75 v85.47,46.75 | 40.64,54.88 30.48,54.88 | v85.47,46.75 85.47,43.77 93.03,43.77 94.36,42.44 v96.02,42.44 99.96,42.44 103.51,45.99 103.51,52.97 109.86,59.33 109.86,62.5 v108.58,62.5 100.97,62.5 100.97,56.15 96.84,56.15 | JP1.1 22.22,52.34
  Top 0.254: 22.22,52.34 23.42,52.34 X11.2 23.42,54.88 30.48,54.88 JP2.2 | 40.64,54.88 42.22,54.88 X12.L2 55.24,56.63 C8.-
  Top 0.406: 89.54,62.5 SW6.P$6 | 96.15,42.44 v96.02,42.44
  Bottom 0.203: X1.4 62.24,37.42 56.52,37.42 53.66,35.83 C6.- 48.58,35.83 44.45,39.64 44.45,44.11 45.09,44.75 SW10.P$6 | SW12.P$6 17.07,24.4 SV2.2 | IC2.8 60.96,49.8 61.91,48.85 64.77,48.85 | 64.77,48.85 IC2.5 | IC1.5 82.84,48.3 82.84,46.89 | 64.77,48.85 66.04,48.85 | 66.04,48.85 IC2.4 | 66.04,48.85 66.04,46.62 67.29,45.38 SW11.P$6 | v85.47,46.75 85.41,46.7 IC1.3 82.84,46.7 82.84,46.89 | JP1.1 10.16,61.23 11.43,62.5 SW2.P$6 | 81.55,46.52 C2.2 | C1.2 83.06,39 81.66,39 C2.2 | C9.2 80.01,46.52 80.01,46.89 C2.2 | C2.2 82.84,46.89
  other vias: 109.86,50.44 109.86,36.47 1.91,50.44 1.91,36.47
  pour Top (isolate 0.254): -1.27,71.39 -1.27,-2.27 113.03,-2.27 113.03,71.39
  pour Bottom (isolate 0.254): 0,71.39 0,0.27 113.03,0.27 113.03,71.39
IN
  Top 0.305: D22.C 61.28,36.03 X1.3 61.2,35.58 62.23,34.56 63.92,34.56 64.99,35.63 64.99,37.73 R1.2
IN_0  (via drill 0.6)
  Top 0.305: SW6.P$1 SW6.P$3 SW5.P$1 SW5.P$3 SW4.P$1 SW4.P$3 SW3.P$1 SW3.P$3 19.13,62.85 15.97,62.85 SW2.P$1 SW2.P$3 4.76,58.12 4.76,32.97 3.81,32.02 SV2.5
  Top 0.406: X10.5 24.13,14.24 v22.86,15.51
  Bottom 0.305: IC1.2 85.81,45.89 86.36,46.45 86.36,49.8 84.77,51.39 84.77,59.01 83.82,59.96 SW6.P$3
  Bottom 0.406: v22.86,15.51 22.86,30.97 19.59,34.24 6.35,34.24 3.97,32.18 2.7,32.18 SV2.5
IN_1  (via drill 0.6, 0.8 pad 1.42)
  Top 0.305: SW11.P$3 SW11.P$1 SW10.P$3 SW10.P$1 SW9.P$3 SW9.P$1 24.64,45.99 23.49,45.99 19.68,45.99 SW8.P$3 15.7,45.99 14.61,45.99 9.53,45.99 SW8.P$1 5.4,45.85 5.4,31.07 3.81,29.48 SV2.4 | v98.42,67.58 v108.58,67.58
  Top 0.406: X10.6 22.86,16.78 v21.59,18.05
  Bottom 0.305: v98.42,67.58 94.61,63.77 87.63,63.77 86.36,62.5 86.36,54.5 85.47,53.61 | SW11.P$1 74.3,52.8 74.3,59.43 76.09,61.23 83.52,61.23 85.47,59.29 85.47,53.61 | 85.47,53.61 IC1.9
  Bottom 0.406: v21.59,18.05 21.59,31.16 19.46,33.29 6.99,33.29 3.81,29.48 SV2.4
IN_2  (via drill 0.6, 0.8 pad 1.42)
  Top 0.305: SW12.P$3 SW12.P$1 SW13.P$3 SW13.P$1 SW14.P$3 SW14.P$1 | SW15.P$1 93.27,21.3 v93.35,21.22 | v96.02,44.98 87.69,44.98 v87,45.67
  Bottom 0.305: v93.35,21.22 97.94,25.82 SW_3.P$1 97.94,43.06 v96.02,44.98 v106.18,44.98 106.18,44.86 | SW14.P$1 57.39,21.3 60.64,18.05 X7.1 66.68,18.12 SW15.P$3 72.67,18.05 X8.1 76.33,18.05 SW15.P$1 | IC1.10 86.27,51.16 87,49.8 v87,45.67
IN_3  (via drill 0.6)
  Top 0.305: SW16.P$1 SW16.P$3 | SW19.P$3 89.98,9.92 v90.49,10.43 | v107.32,25.04 107.32,38.05 106.68,38.69 95.25,38.69 v92.39,41.55
  Bottom 0.305: SW16.P$3 SW17.P$1 SW17.P$3 SW18.P$1 SW18.P$3 SW19.P$1 X7.3 X8.3 SW19.P$3 | v92.39,41.55 92.39,43.77 89.54,46.62 89.54,47.26 87.07,51 IC1.11 | v90.49,10.43 91.12,9.8 97.16,9.8 97.94,10.58 SW_4.P$1 97.94,15.66 v107.32,25.04
LED_PWR  (via drill 0.8 pad 1.42)
  Top 0.406: 79.38,65.04 SW6.P$5
  Top 0.813: 101.71,25.14 96.62,25.14
  Top 1.016: 102.23,14.24 102.23,23.13 LED4.A 101.71,25.14 | 102.23,14.24 LED3.A 102.23,14.24 | SW2.P$5 SW3.P$5 SW4.P$5 SW5.P$5 SW6.P$5 91.26,65.04 93.35,64.09 97.47,64.09 v98.42,65.03 v98.42,65.04 108.59,65.04 110.81,62.82 110.81,59.01 104.78,52.97 104.78,42.81 106.18,41.41 v106.18,39.9 95.62,39.9 92.71,42.81 79.61,42.81 SW11.P$5 79.35,42.84 78.74,43.45 56.44,43.45 SW10.P$5 SW9.P$5 SW8.P$5 10.16,35.37 10.16,29.07 SW12.P$5 SW13.P$5 SW14.P$5 56.44,26.38 57.78,25.04 67.95,25.04 69.29,26.38 SW15.P$5 79.3,26.38 82.13,23.55 82.13,23.35 94.83,23.35 96.62,25.14 | 102.23,14.24 102.23,13.61 101.38,12.77 96.94,12.77 96.2,12.02 96.2,10.75 95.25,9.8 92.71,9.8 91.01,8.09 78.31,8.09 75.06,4.84 SW19.P$5 SW18.P$5 SW17.P$5 SW16.P$5 | JP1.2 7.62,51.07 8.89,49.8 11.43,49.8 12.7,51.07 19.61,51.07 X11.1
  Bottom 1.016: SV2.1 3.81,21.86 14.61,11.07 14.61,7.87 SW16.P$5 | JP1.2 7.62,59.96 2.92,64.66 SW2.P$5
MISO
  Bottom 0.305: IC1.16 91.07,56.41 92.74,58.29 95.57,58.29 SV1.1
MOSI  (via drill 0.6)
  Top 0.305: SV1.4 92.08,63.77 v38.1,63.77
  Bottom 0.305: IC1.15 90.27,56.56 92.71,59.01 92.71,60.59 SV1.4 | JP2.3 33.02,58.69 v38.09,63.77 v38.1,63.77
N$1
  Top 0.406: R8.2 63.06,32.11 X1.1 | D32.C 41.91,35.2 43.56,33.54 C6.+
  Bottom 0.406: X1.1 62.34,31.39 60.32,31.39 58.17,33.54 C6.+
N$2
  Top 0.305: SW6.P$2 SW6.P$4 73.03,67.58 D7.A
N$3
  Top 0.305: SW_4.P$2 D30.A
N$4
  Top 1.422: X12.L1 46.01,53.13 F1.1
N$5
  Top 0.305: SW_3.P$2 104.14,28.58 103.24,29.48 D31.A
N$7
  Bottom 0.305: X7.2 60.32,15.51 D24.A
N$8
  Bottom 0.305: X8.2 78.42,15.51 D25.A
N$9
  Top 0.305: D26.A 84.77,17.41 84.14,16.78 62.23,16.78 60.32,14.88 57.78,14.88 57.15,15.51 50.16,15.51 X10.4
N$10
  Top 0.305: D28.A 83.19,19.96 82.87,20.27 54.93,20.27 X10.2
N$11
  Top 0.305: D27.A 53.02,11.38 X10.3
N$12
  Top 0.305: SW2.P$2 SW2.P$4 1.27,65.93 1.27,57.42 1.91,56.78 D1.A
N$13
  Bottom 0.305: SW8.P$4 SW8.P$2 7.47,37.25 D9.A
N$14
  Top 0.305: SW3.P$4 SW3.P$2 33.66,67.58 D4.A
N$15
  Top 0.305: SW4.P$2 SW4.P$4 39.37,67.58 D5.A
N$16
  Top 0.305: SW5.P$2 SW5.P$4 58.42,67.58 D6.A
N$17
  Bottom 0.305: SW11.P$2 SW11.P$4 79.58,37.73 D12.A
N$18
  Bottom 0.305: SW10.P$2 SW10.P$4 55.83,39.64 55.83,39 D11.A
N$19
  Top 0.305: SW9.P$2 SW9.P$4
  Bottom 0.305: D10.A 36.73,37.2 SW9.P$4
N$20
  Bottom 0.305: SW12.P$2 SW12.P$4 7.47,31.24 D14.A
N$21
  Bottom 0.305: SW13.P$4 SW13.P$2 36.73,31.92 D15.A
N$22
  Bottom 0.305: SW14.P$4 SW14.P$2 55.83,29.99 54.43,31.39 D16.A
N$23
  Bottom 0.305: SW15.P$4 SW15.P$2 79.58,30.96 D17.A
N$24
  Top 0.305: SW16.P$2 SW16.P$4 19.81,2.3 D18.A
N$25
  Top 0.305: SW17.P$4 SW17.P$2 24.64,2.3 D19.A
N$26
  Top 0.305: SW18.P$2 SW18.P$4 | SW18.P$2 45.67,2.32 | D20.A 39.37,2.66 40.49,3.78 44.19,3.78 SW18.P$2
N$27
  Top 0.305: SW19.P$4 SW19.P$2 62.74,0.91 44.45,0.91 D21.A
N$28  (via drill 0.8 pad 1.42)
  Top 0.305: v96.02,37.36 v106.18,37.36 106.18,36.47 101.73,32.02 95.4,32.02 93.98,30.6 D13.A
N$29
  Top 0.305: D29.A X10.1
N$31  (via drill 1 pad 1.42)
  other vias: 97.79,19.32
N$33  (via drill 1 pad 1.42)
  other vias: 104.78,19.32
N$133  (via drill 0.8 pad 1.42)
  Top 0.305: v108.58,59.96 v108.59,59.95
  Bottom 0.305: v108.59,59.96 v108.58,59.96 v98.42,59.96 99.69,58.69 100.97,58.69 102.36,57.3 D8.A
OUT
  Top 0.305: X1.2 61.2,32.9 62.23,33.92 64.14,33.92 65.41,32.66 R2.2
  Top 0.406: R7.2 D23.C 66.04,29.03 R8.1 64.96,31.99 R2.2
OUT_0
  Top 0.305: D9.C D14.C
  Bottom 0.305: D9.C 18.73,37.1 19.05,37.42 19.05,50.44 D1.C 12.07,56.78 11.43,57.42 11.43,60.28 12.38,61.23 13.65,61.23 21.91,69.48 60.62,69.48 68.58,61.53 IC2.15 | D18.C 20.32,30.11 D14.C
OUT_1
  Bottom 0.305: D19.C 24.13,30.75 25.4,32.02 D15.C D10.C 34.29,44.72 D4.C 34.29,57.1 40.96,63.77 62.87,63.77 67.31,59.33 IC2.14
OUT_2
  Bottom 0.305: D20.C 39.37,28.19 42.56,31.39 D16.C D11.C 41.91,37.73 38.73,40.91 D5.C 38.73,59.64 40.32,61.23 56.52,61.23 58.1,62.82 62.55,62.82 66.04,59.33 IC2.13
OUT_3
  Bottom 0.305: D21.C 43.18,15.69 52.52,25.04 64.45,25.04 67.95,28.53 67.95,30.11 69.22,31.39 D17.C 71.12,32.66 71.12,36.47 D12.C 65.41,37.73 63.5,39.64 59.7,39.64 57.78,41.56 D6.C 57.78,60.57 59.08,61.86 62.21,61.86 64.77,59.31 IC2.12
OUT_4
  Top 0.305: D30.C D13.C | D8.C 72.39,57.3 D7.C
  Bottom 0.305: D7.C 72.39,56.15 71.12,54.88 64.14,54.88 63.5,55.52 IC2.11 | D30.C 96.57,16.14 107.32,26.89 107.32,50.7 100.72,57.3 D8.C
OUT_5  (via drill 0.6)
  Top 0.305: v59.05,41.55 D24.C 58.42,27.57 v19.05,27.57
  Bottom 0.305: v59.05,41.55 59.05,60.59 59.69,61.23 60.61,61.23 62.23,59.61 IC2.10 | 58.42,27.57 D24.C | v19.05,27.57 5.08,27.57 4.45,26.94 SV2.3
OUT_6
  Bottom 0.305: IC2.9 60.96,55.52 59.69,54.24 59.69,46.19 66.88,39 74.61,39 81.6,32.02 D25.C
  Bottom 0.406: D25.C D28.C D26.C
OUT_7  (via drill 0.6)
  Top 0.305: v99.06,33.29 96.52,35.83 90.25,35.83 84.53,41.55 v80.65,41.55
  Top 0.406: D29.C 94.62,14.24 95.89,15.51 D31.C
  Bottom 0.305: IC2.7 62.23,52.66 61.91,52.97 60.64,52.97 60.32,52.66 60.32,49.17 67.95,41.55 v80.65,41.55 | D31.C 95.89,21.86 99.06,25.04 v99.06,33.29
  Bottom 0.406: D27.C D29.C
RX
  Bottom 0.305: IC1.30 87.07,42.57 86.04,41.55 86.04,39.64 TP1.TP
SCK  (via drill 0.6)
  Top 0.305: v95.57,56.15 95.57,57.74 SV1.3
  Bottom 0.305: IC1.17 93.92,50.69 95.57,52.34 v95.57,56.15
TX
  Bottom 0.305: IC1.31 86.27,42.72 85.09,41.55 TP2.TP
USB_MINUS  (via drill 0.6)
  Top 0.305: R2.1 69,33.29 v81.92,33.29
  Bottom 0.305: IC1.32 85.47,42.87 84.14,41.55 84.14,39.32 84.46,38.37 84.46,35.83 v81.92,33.29
USB_PLUS  (via drill 0.6)
  Top 0.305: R1.1 68.8,39 81.92,39 v83.19,40.28
  Bottom 0.305: v83.19,40.28 83.19,44.72 83.56,45.09 IC1.1
VCC  (via drill 0.6)
  Top 0.406: R3.2 88.9,51.07 88.9,50.44 88.27,49.8 L1.1
  Top 1.016: L1.1 67.31,49.8 v63.5,53.61 62.48,52.59 C8.+ 50.51,52.59 F1.2 | F1.2 50.51,52.69 | JP2.1 27.94,51.07 29.21,49.8 D32.A 48.26,49.8 50.51,52.05 F1.2
  Bottom 0.406: IC1.4 84.79,47.5 85.21,47.91 85.21,48.73 84.84,49.09 IC1.6 82.16,49.09 80.72,49.09 L1.1
  Bottom 0.61: IC2.16 70.48,58.69 72.71,58.69 73.66,57.74 73.66,55.83 71.44,53.61 v63.5,53.61 IC2.6 | 82.16,49.09 C2.1 | C9.1 77.47,49.8 L1.1
XTAL1
  Bottom 0.305: Q1.1 81.09,50.12 81.31,49.89 IC1.7
  Bottom 0.406: C5.1 76.96,57.55 Q1.1
XTAL2
  Bottom 0.305: IC1.8 81.79,50.69 80.01,52.47 80.01,52.97 80.65,53.61 Q1.2
  Bottom 0.406: C7.1 81.79,57.55 Q1.2

### Text on the board
Bottom: 1 | (c) Wolfman 2013 V1.0
bRestrict: - | + | 1
Measures: 53,46 | 136 | 119,5 | 36.02
Document: Magic
tDocu: I / C / P